# EAGLE design W300C (EAGLE 6.6.0)
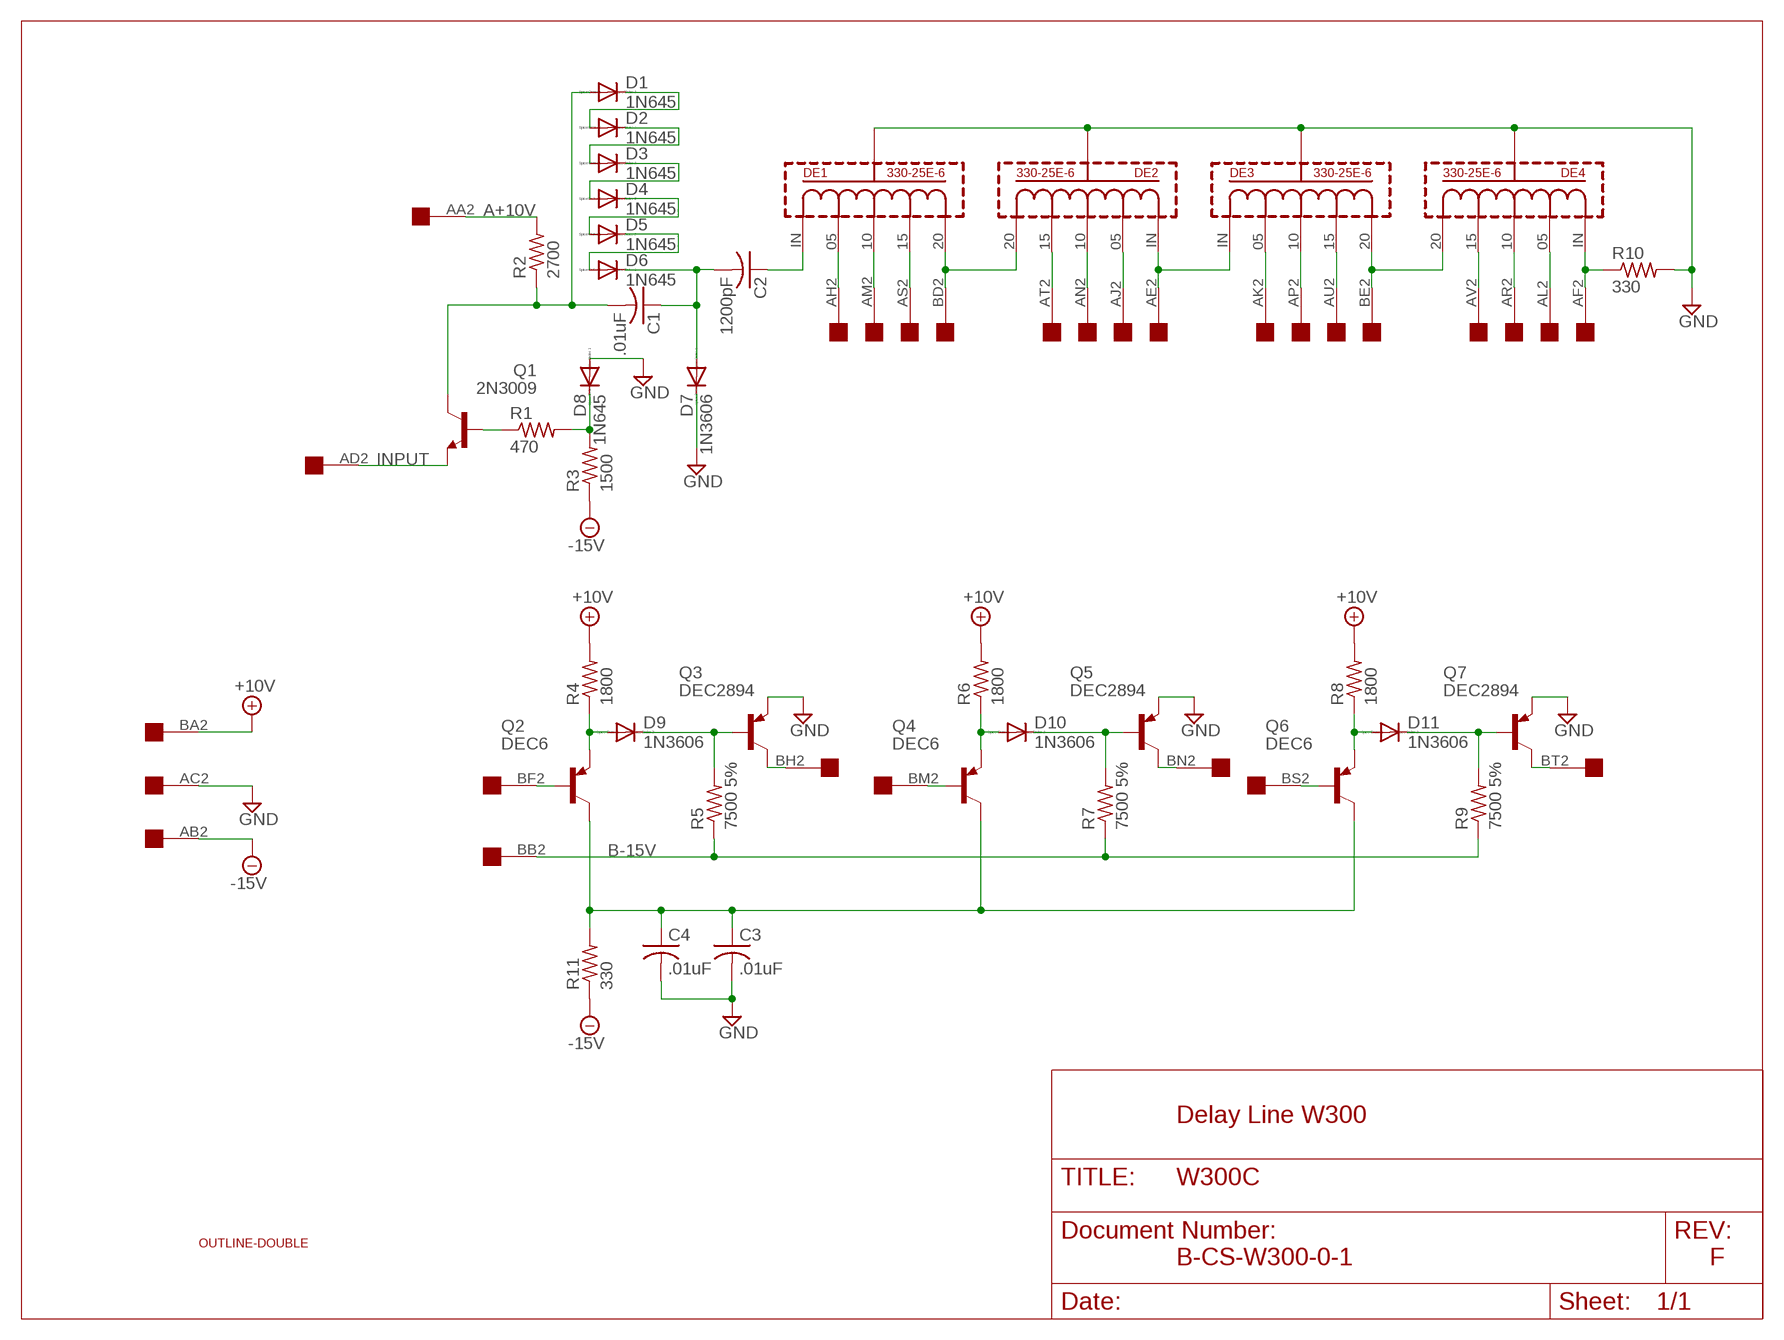
[diagram p0: schematic, sheet 1]

## Parts
C1  .01uF  C-US050-025X075  [C050-025X075]
C2  1200pF  C-US102-043X133  [C102-043X133]
C3  .01uF  C-US050-025X075  [C050-025X075]
C4  .01uF  C-US050-025X075  [C050-025X075]
D1  1N645  1N4148DO35-10  [DO35-10]
D2  1N645  1N4148DO35-10  [DO35-10]
D3  1N645  1N4148DO35-10  [DO35-10]
D4  1N645  1N4148DO35-10  [DO35-10]
D5  1N645  1N4148DO35-10  [DO35-10]
D6  1N645  1N4148DO35-10  [DO35-10]
D7  1N3606  1N4148DO35-10  [DO35-10]
D8  1N645  1N4148DO35-10  [DO35-10]
D9  1N3606  1N4148DO35-10  [DO35-10]
D10  1N3606  1N4148DO35-10  [DO35-10]
D11  1N3606  1N4148DO35-10  [DO35-10]
DE1  330-25E-6  330-25E  [330-25E]
DE2  330-25E-6  330-25E  [330-25E]
DE3  330-25E-6  330-25E  [330-25E]
DE4  330-25E-6  330-25E  [330-25E]
Q1  2N3009  2N2219  [TO5]
Q2  DEC6  2N2905  [TO5]
Q3  DEC2894  2N2905  [TO5]
Q4  DEC6  2N2905  [TO5]
Q5  DEC2894  2N2905  [TO5]
Q6  DEC6  2N2905  [TO5]
Q7  DEC2894  2N2905  [TO5]
R1  470  R-US_0207/10  [0207/10]
R2  2700  R-US_0207/10  [0207/10]
R3  1500  R-US_0207/10  [0207/10]
R4  1800  R-US_0207/10  [0207/10]
R5  7500 5%  R-US_0207/10  [0207/10]
R6  1800  R-US_0207/10  [0207/10]
R7  7500 5%  R-US_0207/10  [0207/10]
R8  1800  R-US_0207/10  [0207/10]
R9  7500 5%  R-US_0207/10  [0207/10]
R10  330  R-US_0207/10  [0207/10]
R11  330  R-US_0207/10  [0207/10]
U$1  OUTLINE-DOUBLE  [DOUBLE]
U$3  DOUBLE  [EDGE-CON4]

## Nets
+10V [Supply]: R4.2 R6.2 R8.2 U$3.BA2
-15V [Supply]: R3.1 R11.1 U$3.AB2
A+10V [Supply]: R2.2 U$3.AA2
B-15V [Supply]: R5.1 R7.1 R9.1 U$3.BB2
GND [Supply]: C3.2 C4.2 D7.C D8.A DE1.GND DE2.GND DE3.GND DE4.GND Q3.1(E) Q5.1(E) Q7.1(E) R10.2 U$3.AC2
INPUT: Q1.1(E) U$3.AD2
N$1: DE1.05 U$3.AH2
N$2: DE1.10 U$3.AM2
N$3: DE1.15 U$3.AS2
N$4: DE1.20 DE2.20 U$3.BD2
N$5: DE2.15 U$3.AT2
N$6: DE2.10 U$3.AN2
N$7: DE2.05 U$3.AJ2
N$8: DE2.IN DE3.IN U$3.AE2
N$9: DE3.05 U$3.AK2
N$10: DE3.10 U$3.AP2
N$11: DE3.15 U$3.AU2
N$12: DE3.20 DE4.20 U$3.BE2
N$13: DE4.15 U$3.AV2
N$14: DE4.10 U$3.AR2
N$15: DE4.05 U$3.AL2
N$16: DE4.IN R10.1 U$3.AF2
N$17: C2.1 DE1.IN
N$18: Q1.2(B) R1.1
N$19: D8.C R1.2 R3.2
N$20: C1.1 C2.2 D6.C D7.A
N$21: D5.C D6.A
N$22: D4.C D5.A
N$23: D3.C D4.A
N$24: D1.C D2.A
N$25: D2.C D3.A
N$26 [Supply]: C1.2 D1.A Q1.3(C) R2.1
N$27: Q2.2(B) U$3.BF2
N$28: C3.1 C4.1 Q2.3(C) Q4.3(C) Q6.3(C) R11.2
N$29: D9.A Q2.1(E) R4.1
N$30: D9.C Q3.2(B) R5.2
N$32: Q3.3(C) U$3.BH2
N$33: Q4.2(B) U$3.BM2
N$35: D10.A Q4.1(E) R6.1
N$36: D10.C Q5.2(B) R7.2
N$37: Q5.3(C) U$3.BN2
N$38: Q6.2(B) U$3.BS2
N$40: D11.A Q6.1(E) R8.1
N$41: D11.C Q7.2(B) R9.2
N$42: Q7.3(C) U$3.BT2
Unconnected: U$3.AA1 U$3.AB1 U$3.AC1 U$3.AD1 U$3.AE1 U$3.AF1 U$3.AH1 U$3.AJ1 U$3.AK1 U$3.AL1 U$3.AM1 U$3.AN1 U$3.AP1 U$3.AR1 U$3.AS1 U$3.AT1 U$3.AU1 U$3.AV1 U$3.BA1 U$3.BB1 U$3.BC1 U$3.BC2 U$3.BD1 U$3.BE1 U$3.BF1 U$3.BH1 U$3.BJ1 U$3.BJ2 U$3.BK1 U$3.BK2 U$3.BL1 U$3.BL2 U$3.BM1 U$3.BN1 U$3.BP1 U$3.BP2 U$3.BR1 U$3.BR2 U$3.BS1 U$3.BT1 U$3.BU1 U$3.BU2 U$3.BV1 U$3.BV2

## Notes on the sheet
- Delay Line W300
- B-CS-W300-0-1 | F

## Library data of the parts
C1-C4 = rcl:C-US: CAPACITOR, American symbol
D1-D11 = diode:1N4148: DIODE high speed (Philips)
DE1-DE4 = dec-con:330-25E: Tapped Delay Line
Q1 = transistor-npn:2N2219: NPN Transistor
Q2-Q7 = transistor-pnp:2N2905: PNP Transistor
R1-R11 = rcl:R-US_: RESISTOR, American symbol
U$1 = dec-con:OUTLINE-*: Board outlines for DEC boards.
U$3 = dec-con:DOUBLE: Double-Height DEC board

## Net classes
1 Supply: width 0.813 mm

## Board
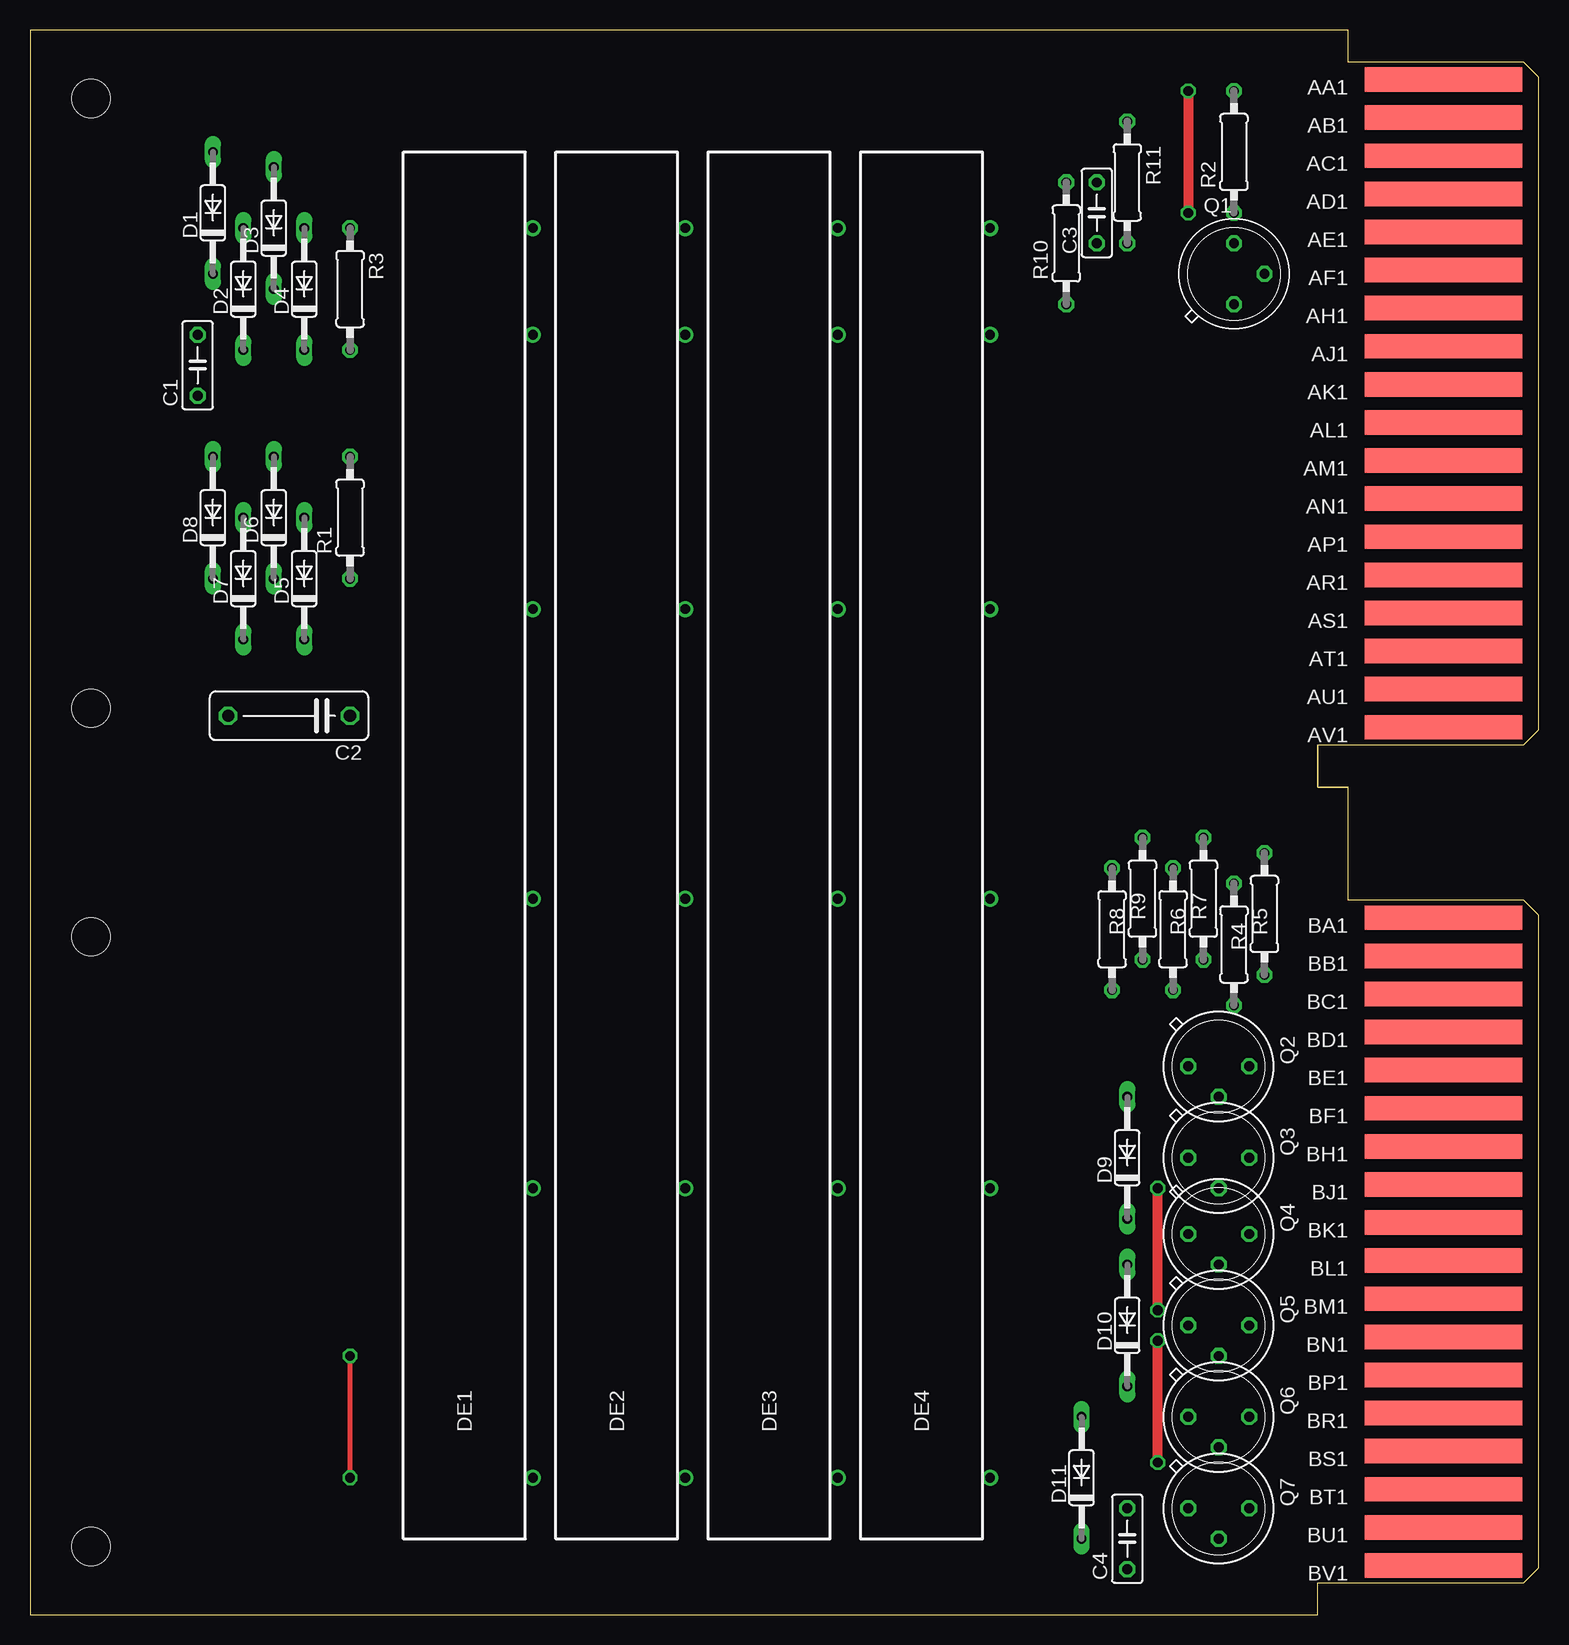
[diagram p1: board, top side]
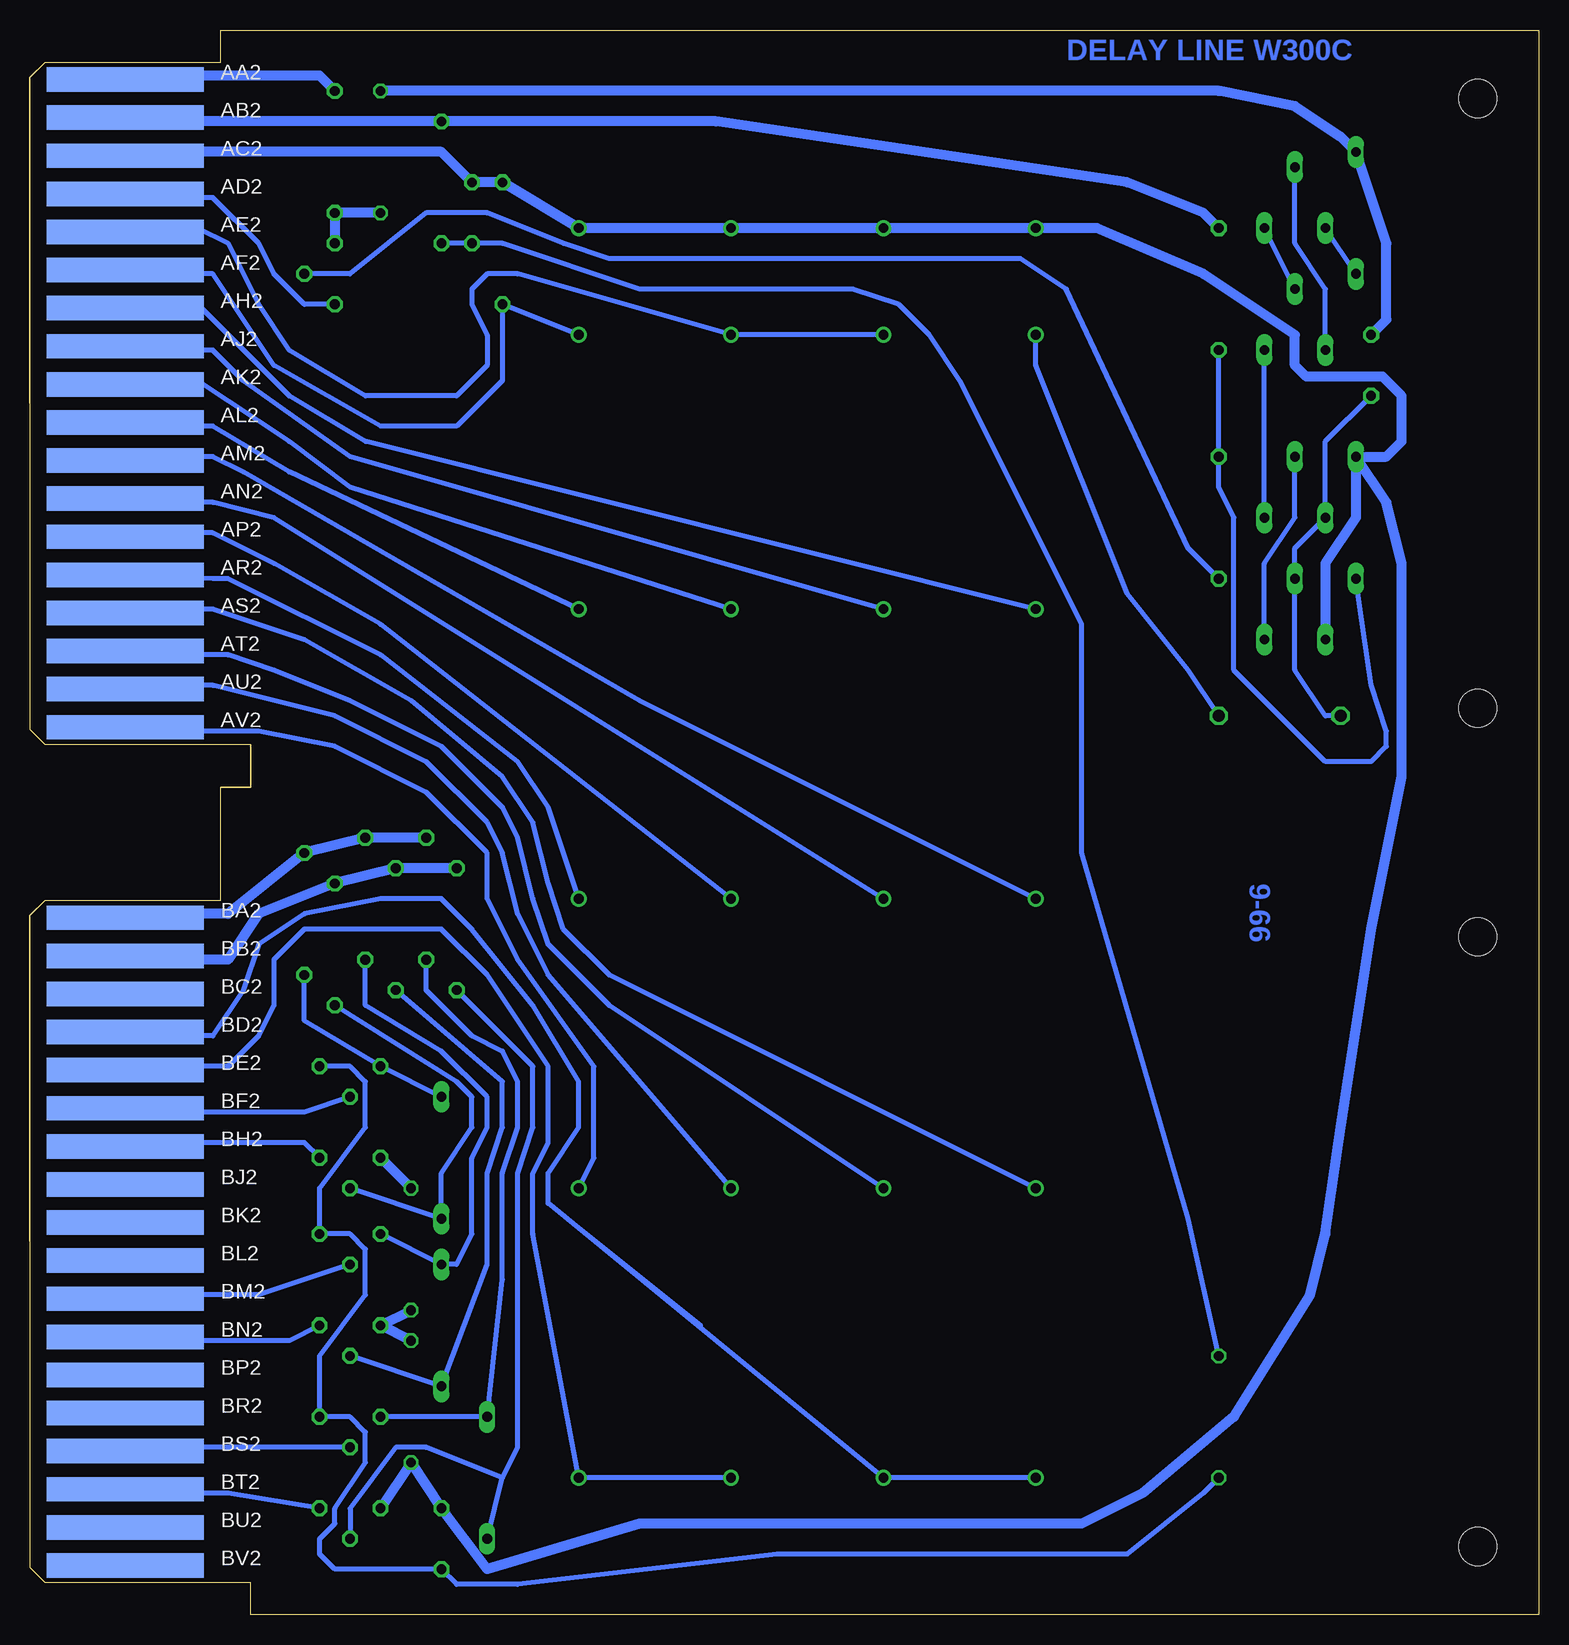
[diagram p2: board, bottom side, seen from below]

Size 125.73 x 132.08 mm. Coordinates in mm from the lower left corner, seen from the top.
Copper layers (1+16): Top 0.035mm / dielectric 1.5mm / Bottom 0.035mm
Design rules "16mils": minimum track width 16mil, minimum drill 32mil, track to track 15mil, track to pad 10mil, pad to pad 10mil, via to via 10mil, smd to smd 10mil, copper to edge 13mil, drill to drill 10mil, minimum pad ring 10mil, minimum via ring 8mil, stop-mask expansion 0mil, vias tented up to drill 0mil, thermal gap 10mil

### Footprints (pad centres in the part's own frame; a part is rotated, then mirrored left to right if it is on the bottom)
C050-025X075 = drill 0.813 octagon: 1 -2.54,0; 2 2.54,0
C102-043X133 = drill 1.016 octagon: 1 -5.08,0; 2 5.08,0
DO35-10 = drill 0.813 long: A 5.08,0; C -5.08,0
330-25E = drill 0.813: 05 77.47,0; 10 53.34,0; 15 29.21,0; 20 5.08,0; GND 109.22,0; IN 100.33,0
TO5 = drill 0.813 octagon: 1 0,-2.54; 2 2.54,0; 3 0,2.54
0207/10 = drill 0.813 octagon: 1 -5.08,0; 2 5.08,0
DOUBLE = hole 3.175: 120.65,56.515; 120.65,5.715; 120.65,75.565; 120.65,126.365
EDGE-CON4 = smd 13.106 x 2.032: AA1 7.938,4.128; AB1 7.938,7.303; AC1 7.938,10.477; AD1 7.938,13.652; AE1 7.938,16.828; AF1 7.938,20.003; AH1 7.938,23.177; AJ1 7.938,26.352; AK1 7.938,29.527; AL1 7.938,32.703; AM1 7.938,35.877; AN1 7.938,39.053; AP1 7.938,42.227; AR1 7.938,45.403; AS1 7.938,48.578; AT1 7.938,51.752; AU1 7.938,54.928; AV1 7.938,58.102; BA1 7.938,73.978; BB1 7.938,77.153; BC1 7.938,80.328; BD1 7.938,83.502; BE1 7.938,86.677; BF1 7.938,89.853; BH1 7.938,93.028; BJ1 7.938,96.203; BK1 7.938,99.377; BL1 7.938,102.552; BM1 7.938,105.728; BN1 7.938,108.903; BP1 7.938,112.078; BR1 7.938,115.252; BS1 7.938,118.427; BT1 7.938,121.603; BU1 7.938,124.778; BV1 7.938,127.953 | smd 13.106 x 2.032 bottom: AA2 7.938,4.128; AB2 7.938,7.303; AC2 7.938,10.477; AD2 7.938,13.652; AE2 7.938,16.828; AF2 7.938,20.003; AH2 7.938,23.177; AJ2 7.938,26.352; AK2 7.938,29.527; AL2 7.938,32.703; AM2 7.938,35.877; AN2 7.938,39.053; AP2 7.938,42.227; AR2 7.938,45.403; AS2 7.938,48.578; AT2 7.938,51.752; AU2 7.938,54.928; AV2 7.938,58.102; BA2 7.938,73.978; BB2 7.938,77.153; BC2 7.938,80.328; BD2 7.938,83.502; BE2 7.938,86.677; BF2 7.938,89.853; BH2 7.938,93.028; BJ2 7.938,96.203; BK2 7.938,99.377; BL2 7.938,102.552; BM2 7.938,105.728; BN2 7.938,108.903; BP2 7.938,112.078; BR2 7.938,115.252; BS2 7.938,118.427; BT2 7.938,121.603; BU2 7.938,124.778; BV2 7.938,127.953

### Placement (x,y rotation side)
C1  13.97,104.14 90 top
C2  21.59,74.93 180 top
C3  88.9,116.84 90 top
C4  91.44,6.35 90 top
D1  15.24,116.84 90 top
D2  17.78,110.49 90 top
D3  20.32,115.57 90 top
D4  22.86,110.49 90 top
D5  22.86,86.36 90 top
D6  20.32,91.44 90 top
D7  17.78,86.36 90 top
D8  15.24,91.44 90 top
D9  91.44,38.1 90 top
D10  91.44,24.13 90 top
D11  87.63,11.43 90 top
DE1  41.91,6.35 90 top
DE2  54.61,6.35 90 top
DE3  67.31,6.35 90 top
DE4  80.01,6.35 90 top
Q1  100.33,111.76 0 top
Q2  99.06,45.72 270 top
Q3  99.06,38.1 270 top
Q4  99.06,31.75 270 top
Q5  99.06,24.13 270 top
Q6  99.06,16.51 270 top
Q7  99.06,8.89 270 top
R1  26.67,91.44 90 top
R2  100.33,121.92 90 top
R3  26.67,110.49 270 top
R4  102.87,58.42 90 top
R5  100.33,55.88 270 top
R6  97.79,59.69 90 top
R7  95.25,57.15 270 top
R8  92.71,59.69 90 top
R9  90.17,57.15 270 top
R10  86.36,114.3 90 top
R11  91.44,119.38 270 top
U$1  125.73,132.08 180 top
U$3  125.73,132.08 180 top

### Tracks (layer width: path | path; a pad name or v marks a point on that pad's centre or on a via)
+10V
  Bottom 0.813: U$3.BA2 116.84,58.42 109.22,58.42 R4.2 R6.2 R8.2
-15V
  Bottom 0.813: U$3.AB2 116.84,124.46 R11.1 68.58,124.46 34.29,119.38 27.94,116.84 R3.1
A+10V
  Bottom 0.813: U$3.AA2 115.57,128.27 101.6,128.27 R2.2
B-15V
  Bottom 0.813: R9.1 R7.1 R5.1 106.68,58.42 109.22,54.61 116.84,54.61 U$3.BB2
GND  (via drill 0.81)
  Top 0.813: v93.98,12.7 v93.98,22.86 | v93.98,25.4 v93.98,35.56
  Bottom 0.813: Q7.1 v93.98,12.7 C4.2 87.63,3.81 74.93,7.62 38.1,7.62 33.02,10.16 25.4,16.51 19.05,26.67 17.78,31.75 16.51,40.64 13.97,57.15 11.43,69.85 11.43,87.63 12.7,92.71 D8.A | v93.98,22.86 Q5.1 v93.98,25.4 | v93.98,35.56 Q3.1 | D7.C 17.78,87.63 15.24,91.44 D8.A | D8.A 12.7,96.52 11.43,97.79 11.43,101.6 13.02,103.19 19.37,103.19 20.32,104.14 20.32,106.68 27.94,111.76 36.83,115.57 DE1.GND DE2.GND DE3.GND DE4.GND R10.2 C3.2 91.44,121.92 116.84,121.92 U$3.AC2
INPUT
  Bottom 0.406: U$3.AD2 116.84,118.11 110.49,118.11 106.68,114.3 105.41,111.76 102.87,109.22 Q1.1
N$1
  Bottom 0.406: DE1.05 97.79,97.79 104.14,101.6 111.76,109.22 116.84,109.22 U$3.AH2
N$2
  Bottom 0.406: DE1.10 74.93,76.2 107.95,95.25 110.49,96.52 116.84,96.52 U$3.AM2
N$3
  Bottom 0.406: DE1.15 77.47,53.34 81.28,57.15 82.55,60.96 83.82,66.04 86.36,69.85 93.98,76.2 102.87,81.28 110.49,83.82 116.84,83.82 U$3.AS2
N$4
  Bottom 0.406: U$3.BD2 116.84,48.26 110.49,48.26 107.95,52.07 106.68,55.88 102.87,58.42 96.52,59.69 91.44,59.69 88.9,57.15 83.82,50.8 80.01,44.45 80.01,40.64 82.55,36.83 82.55,34.29 | 82.55,34.29 69.85,24.13 | 82.55,34.29 DE2.20 DE1.20
N$5
  Bottom 0.406: DE2.15 77.47,50.8 82.55,55.88 83.82,59.69 85.09,64.77 86.36,67.31 91.44,72.39 99.06,76.2 105.41,78.74 109.22,80.01 116.84,80.01 U$3.AT2
N$6
  Bottom 0.406: DE2.10 105.41,91.44 110.49,92.71 116.84,92.71 U$3.AN2
N$7
  Bottom 0.406: DE2.05 99.06,96.52 107.95,102.87 110.49,105.41 116.84,105.41 U$3.AJ2
N$8
  Bottom 0.406: DE2.IN DE3.IN 85.09,111.76 87.63,111.76 88.9,110.49 88.9,109.22 87.63,106.68 87.63,104.14 90.17,101.6 97.79,101.6 104.14,105.41 106.68,109.22 109.22,114.3 111.76,115.57 116.84,115.57 U$3.AE2
N$9
  Bottom 0.406: U$3.AK2 116.84,102.87 111.76,102.87 104.14,97.79 99.06,93.98 DE3.05
N$10
  Bottom 0.406: DE3.10 96.52,82.55 105.41,87.63 110.49,90.17 116.84,90.17 U$3.AP2
N$11
  Bottom 0.406: U$3.AU2 116.84,77.47 110.49,77.47 100.33,74.93 92.71,71.12 87.63,66.04 86.36,63.5 85.09,58.42 82.55,53.34 DE3.15
N$12
  Bottom 0.406: DE3.20 DE4.20 83.82,31.75 83.82,36.83 82.55,39.37 82.55,45.72 87.63,53.34 91.44,57.15 102.87,57.15 105.41,54.61 105.41,50.8 106.68,48.26 109.22,45.72 116.84,45.72 U$3.BE2
N$13
  Bottom 0.406: DE4.15 78.74,38.1 78.74,45.72 85.09,54.61 87.63,59.69 87.63,63.5 92.71,68.58 100.33,72.39 106.68,73.66 116.84,73.66 U$3.AV2
N$14
  Bottom 0.406: DE4.10 82.55,67.31 85.09,71.12 96.52,80.01 109.22,86.36 110.49,86.36 U$3.AR2
N$15
  Bottom 0.406: DE4.05 104.14,95.25 110.49,99.06 116.84,99.06 U$3.AL2
N$16
  Bottom 0.406: DE4.IN R10.1 86.36,102.87 90.17,99.06 96.52,99.06 105.41,104.14 110.49,111.76 116.84,111.76 U$3.AF2
N$17
  Bottom 0.406: C2.1 29.21,78.74 34.29,85.09 41.91,104.14 DE1.IN
N$18
  Bottom 0.406: Q1.2 99.06,111.76 92.71,116.84 87.63,116.84 81.28,114.3 77.47,113.03 43.18,113.03 39.37,110.49 29.21,88.9 R1.1
N$19
  Bottom 0.406: D8.C 13.97,77.47 12.7,73.66 12.7,72.39 13.97,71.12 17.78,71.12 25.4,78.74 25.4,91.44 26.67,93.98 R1.2 R3.2
N$20
  Bottom 0.406: C2.2 17.78,74.93 20.32,78.74 D6.C 20.32,88.9 D7.A 17.78,97.79 C1.1
N$21
  Bottom 0.406: D6.A 20.32,91.44 22.86,87.63 D5.C
N$22
  Bottom 0.406: D5.A D4.C
N$23
  Bottom 0.406: D3.C D4.A
N$24
  Bottom 0.406: D1.C D2.A
N$25
  Bottom 0.406: D2.C 17.78,110.49 20.32,114.3 D3.A
N$26  (via drill 0.81)
  Top 0.813: v96.52,127 v96.52,116.84
  Bottom 0.813: C1.2 12.7,107.95 12.7,114.3 D1.A 16.51,123.19 20.32,125.73 26.67,127 v96.52,127 | Q1.3 R2.1 v96.52,116.84
N$27
  Bottom 0.406: U$3.BF2 116.84,41.91 102.87,41.91 Q2.2
N$28  (via drill 0.81)
  Top 0.406: v26.67,11.43 v26.67,21.59
  Bottom 0.406: Q2.3 99.06,45.72 97.79,44.45 97.79,40.64 101.6,35.56 Q4.3 99.06,31.75 97.79,30.48 97.79,26.67 101.6,21.59 Q6.3 99.06,16.51 97.79,15.24 97.79,12.7 100.33,8.89 100.33,7.62 101.6,6.35 101.6,5.08 100.33,3.81 C4.1 90.17,2.54 85.09,2.54 63.5,5.08 34.29,5.08 27.94,10.16 v26.67,11.43 | v26.67,21.59 29.21,33.02 38.1,63.5 38.1,82.55 48.26,102.87 50.8,106.68 53.34,109.22 57.15,110.49 74.93,110.49 86.36,114.3 C3.1 R11.2
N$29
  Bottom 0.406: D9.A Q2.1 102.87,49.53 R4.1
N$30
  Bottom 0.406: R5.2 90.17,44.45 88.9,43.18 88.9,40.64 91.44,36.83 D9.C Q3.2
N$32
  Bottom 0.406: U$3.BH2 116.84,39.37 102.87,39.37 Q3.3
N$33
  Bottom 0.406: U$3.BM2 116.84,26.67 106.68,26.67 Q4.2
N$35
  Bottom 0.406: Q4.1 D10.A 90.17,29.21 88.9,31.75 88.9,38.1 87.63,40.64 87.63,43.18 91.44,46.99 97.79,50.8 R6.1
N$36
  Bottom 0.406: Q5.2 D10.C 87.63,29.21 87.63,36.83 86.36,40.64 86.36,44.45 R7.2
N$37
  Bottom 0.406: U$3.BN2 116.84,22.86 104.14,22.86 Q5.3
N$38
  Bottom 0.406: U$3.BS2 116.84,13.97 Q6.2
N$40
  Bottom 0.406: R8.1 92.71,52.07 88.9,48.26 86.36,46.99 85.09,44.45 85.09,40.64 86.36,36.83 86.36,27.94 D11.A Q6.1
N$41
  Bottom 0.406: Q7.2 99.06,8.89 95.25,13.97 92.71,13.97 86.36,11.43 | D11.C 86.36,11.43 | R9.2 83.82,45.72 83.82,40.64 85.09,36.83 85.09,13.97 86.36,11.43
N$42
  Bottom 0.406: U$3.BT2 116.84,10.16 109.22,10.16 Q7.3

### Text on the board
Bottom: DELAY LINE W300C | 9-66